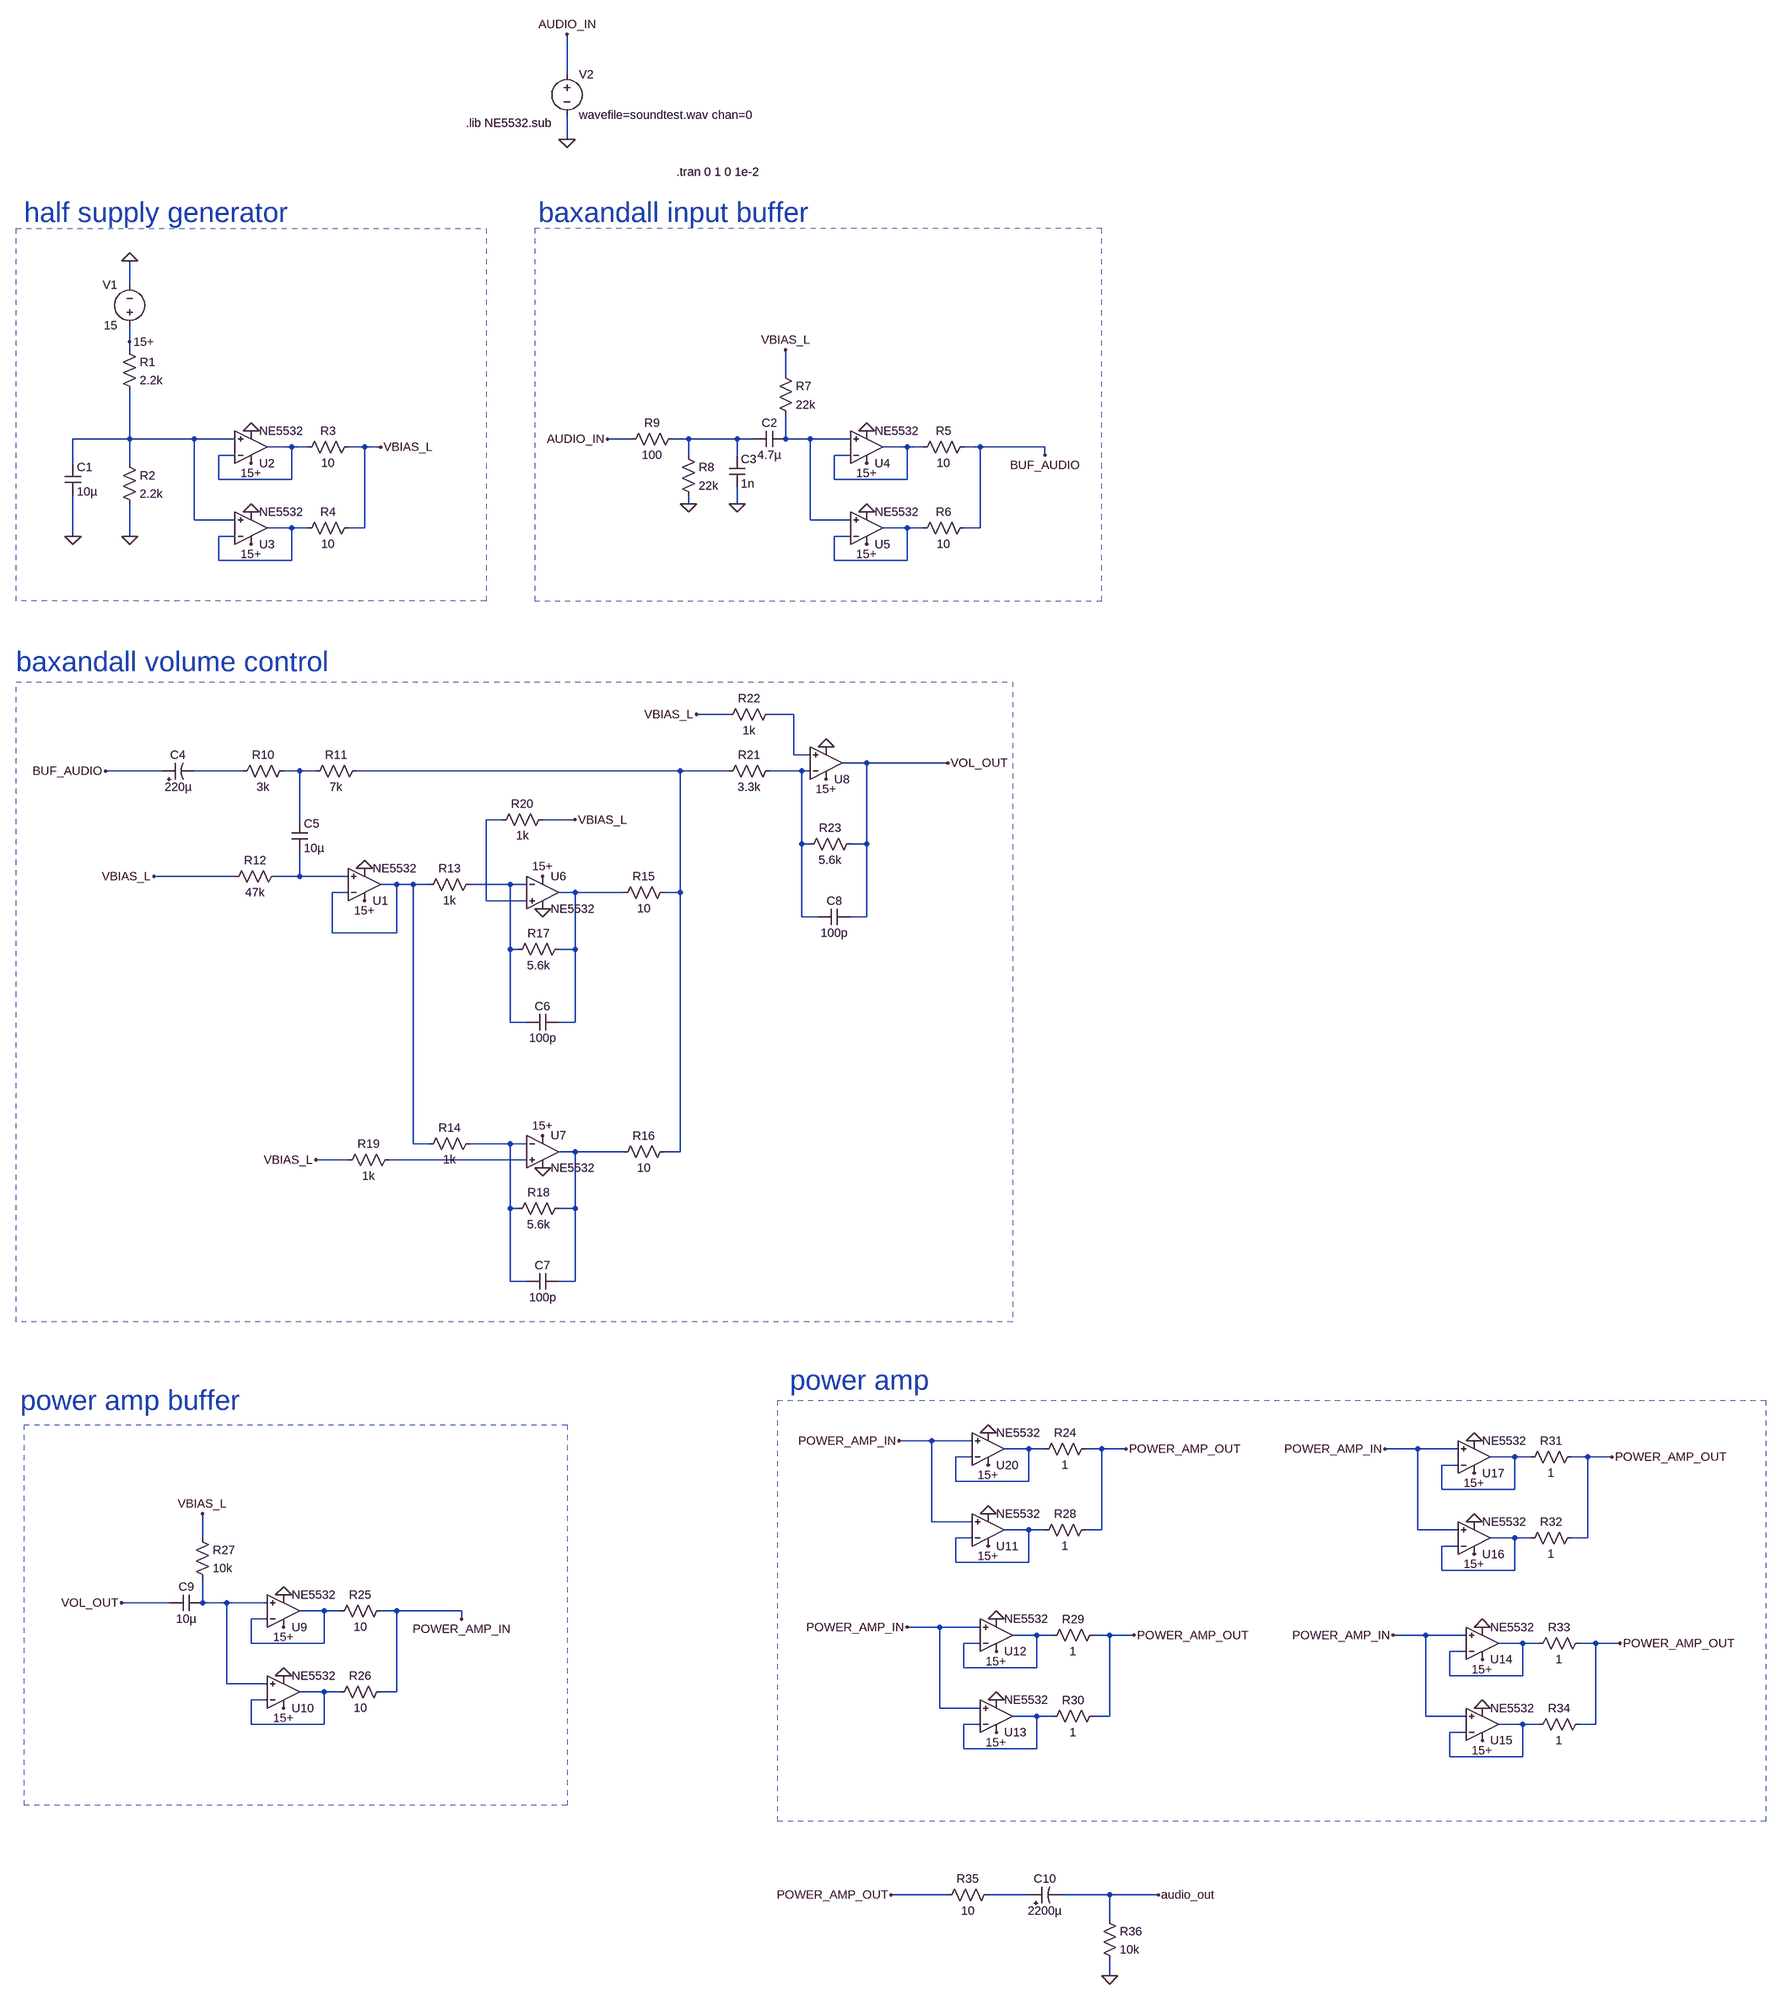
[diagram p0: schematic Amp sim.asc]
Amp sim.asc, the LTspice schematic file:
Version 4
SHEET 1 3236 3316
WIRE 864 -480 864 -560
WIRE 864 -352 864 -400
WIRE 0 -64 0 -112
WIRE 0 48 0 16
WIRE 0 64 0 48
WIRE 1296 112 1296 64
WIRE 0 240 0 144
WIRE 0 240 -112 240
WIRE 128 240 0 240
WIRE 208 240 128 240
WIRE 992 240 944 240
WIRE 1104 240 1072 240
WIRE 1200 240 1104 240
WIRE 1232 240 1200 240
WIRE 1296 240 1296 192
WIRE 1344 240 1296 240
WIRE 1424 240 1344 240
WIRE 320 256 272 256
WIRE 352 256 320 256
WIRE 464 256 432 256
WIRE 496 256 464 256
WIRE 1536 256 1488 256
WIRE 1568 256 1536 256
WIRE 1680 256 1648 256
WIRE 1808 256 1680 256
WIRE 208 272 176 272
WIRE 1104 272 1104 240
WIRE 1200 272 1200 240
WIRE 1424 272 1392 272
WIRE 1808 272 1808 256
WIRE -112 288 -112 240
WIRE 0 288 0 240
WIRE 176 320 176 272
WIRE 320 320 320 256
WIRE 320 320 176 320
WIRE 1392 320 1392 272
WIRE 1536 320 1536 256
WIRE 1536 320 1392 320
WIRE 1104 368 1104 352
WIRE 1200 368 1200 336
WIRE 128 400 128 240
WIRE 208 400 128 400
WIRE 1344 400 1344 240
WIRE 1424 400 1344 400
WIRE 320 416 272 416
WIRE 352 416 320 416
WIRE 464 416 464 256
WIRE 464 416 432 416
WIRE 1536 416 1488 416
WIRE 1568 416 1536 416
WIRE 1680 416 1680 256
WIRE 1680 416 1648 416
WIRE -112 432 -112 352
WIRE 0 432 0 368
WIRE 208 432 176 432
WIRE 1424 432 1392 432
WIRE 176 480 176 432
WIRE 320 480 320 416
WIRE 320 480 176 480
WIRE 1392 480 1392 432
WIRE 1536 480 1536 416
WIRE 1536 480 1392 480
WIRE 1184 784 1120 784
WIRE 1312 784 1264 784
WIRE 1312 864 1312 784
WIRE 1344 864 1312 864
WIRE 1456 880 1408 880
WIRE 1616 880 1456 880
WIRE 64 896 -48 896
WIRE 224 896 128 896
WIRE 336 896 304 896
WIRE 368 896 336 896
WIRE 1088 896 448 896
WIRE 1184 896 1088 896
WIRE 1328 896 1264 896
WIRE 1344 896 1328 896
WIRE 336 992 336 896
WIRE 736 992 704 992
WIRE 880 992 816 992
WIRE 1328 1040 1328 896
WIRE 1344 1040 1328 1040
WIRE 1456 1040 1456 880
WIRE 1456 1040 1424 1040
WIRE 208 1104 48 1104
WIRE 336 1104 336 1056
WIRE 336 1104 288 1104
WIRE 432 1104 336 1104
WIRE 528 1120 496 1120
WIRE 560 1120 528 1120
WIRE 592 1120 560 1120
WIRE 752 1120 672 1120
WIRE 784 1120 752 1120
WIRE 432 1136 400 1136
WIRE 880 1136 848 1136
WIRE 976 1136 880 1136
WIRE 1088 1136 1088 896
WIRE 1088 1136 1056 1136
WIRE 704 1152 704 992
WIRE 784 1152 704 1152
WIRE 1328 1184 1328 1040
WIRE 1360 1184 1328 1184
WIRE 1456 1184 1456 1040
WIRE 1456 1184 1424 1184
WIRE 400 1216 400 1136
WIRE 528 1216 528 1120
WIRE 528 1216 400 1216
WIRE 752 1248 752 1120
WIRE 768 1248 752 1248
WIRE 880 1248 880 1136
WIRE 880 1248 848 1248
WIRE 752 1392 752 1248
WIRE 784 1392 752 1392
WIRE 880 1392 880 1248
WIRE 880 1392 848 1392
WIRE 560 1632 560 1120
WIRE 592 1632 560 1632
WIRE 752 1632 672 1632
WIRE 784 1632 752 1632
WIRE 880 1648 848 1648
WIRE 976 1648 880 1648
WIRE 1088 1648 1088 1136
WIRE 1088 1648 1056 1648
WIRE 432 1664 368 1664
WIRE 784 1664 512 1664
WIRE 752 1760 752 1632
WIRE 768 1760 752 1760
WIRE 880 1760 880 1648
WIRE 880 1760 848 1760
WIRE 752 1904 752 1760
WIRE 784 1904 752 1904
WIRE 880 1904 880 1760
WIRE 880 1904 848 1904
WIRE 1584 2224 1520 2224
WIRE 1664 2224 1584 2224
WIRE 1776 2240 1728 2240
WIRE 1808 2240 1776 2240
WIRE 1920 2240 1888 2240
WIRE 1968 2240 1920 2240
WIRE 2544 2240 2480 2240
WIRE 2624 2240 2544 2240
WIRE 1664 2256 1632 2256
WIRE 2736 2256 2688 2256
WIRE 2768 2256 2736 2256
WIRE 2880 2256 2848 2256
WIRE 2928 2256 2880 2256
WIRE 2624 2272 2592 2272
WIRE 1632 2304 1632 2256
WIRE 1776 2304 1776 2240
WIRE 1776 2304 1632 2304
WIRE 2592 2320 2592 2272
WIRE 2736 2320 2736 2256
WIRE 2736 2320 2592 2320
WIRE 1584 2384 1584 2224
WIRE 1664 2384 1584 2384
WIRE 1776 2400 1728 2400
WIRE 1808 2400 1776 2400
WIRE 1920 2400 1920 2240
WIRE 1920 2400 1888 2400
WIRE 2544 2400 2544 2240
WIRE 2624 2400 2544 2400
WIRE 144 2416 144 2368
WIRE 1664 2416 1632 2416
WIRE 2736 2416 2688 2416
WIRE 2768 2416 2736 2416
WIRE 2880 2416 2880 2256
WIRE 2880 2416 2848 2416
WIRE 2624 2432 2592 2432
WIRE 1632 2464 1632 2416
WIRE 1776 2464 1776 2400
WIRE 1776 2464 1632 2464
WIRE 2592 2480 2592 2432
WIRE 2736 2480 2736 2416
WIRE 2736 2480 2592 2480
WIRE 80 2544 -16 2544
WIRE 144 2544 144 2496
WIRE 192 2544 144 2544
WIRE 272 2544 192 2544
WIRE 384 2560 336 2560
WIRE 416 2560 384 2560
WIRE 528 2560 496 2560
WIRE 656 2560 528 2560
WIRE 272 2576 240 2576
WIRE 656 2576 656 2560
WIRE 1600 2592 1536 2592
WIRE 1680 2592 1600 2592
WIRE 1792 2608 1744 2608
WIRE 1824 2608 1792 2608
WIRE 1936 2608 1904 2608
WIRE 1984 2608 1936 2608
WIRE 2560 2608 2496 2608
WIRE 2640 2608 2560 2608
WIRE 240 2624 240 2576
WIRE 384 2624 384 2560
WIRE 384 2624 240 2624
WIRE 1680 2624 1648 2624
WIRE 2752 2624 2704 2624
WIRE 2784 2624 2752 2624
WIRE 2896 2624 2864 2624
WIRE 2944 2624 2896 2624
WIRE 2640 2640 2608 2640
WIRE 1648 2672 1648 2624
WIRE 1792 2672 1792 2608
WIRE 1792 2672 1648 2672
WIRE 2608 2688 2608 2640
WIRE 2752 2688 2752 2624
WIRE 2752 2688 2608 2688
WIRE 192 2704 192 2544
WIRE 272 2704 192 2704
WIRE 384 2720 336 2720
WIRE 416 2720 384 2720
WIRE 528 2720 528 2560
WIRE 528 2720 496 2720
WIRE 272 2736 240 2736
WIRE 1600 2752 1600 2592
WIRE 1680 2752 1600 2752
WIRE 1792 2768 1744 2768
WIRE 1824 2768 1792 2768
WIRE 1936 2768 1936 2608
WIRE 1936 2768 1904 2768
WIRE 2560 2768 2560 2608
WIRE 2640 2768 2560 2768
WIRE 240 2784 240 2736
WIRE 384 2784 384 2720
WIRE 384 2784 240 2784
WIRE 1680 2784 1648 2784
WIRE 2752 2784 2704 2784
WIRE 2784 2784 2752 2784
WIRE 2896 2784 2896 2624
WIRE 2896 2784 2864 2784
WIRE 2640 2800 2608 2800
WIRE 1648 2832 1648 2784
WIRE 1792 2832 1792 2768
WIRE 1792 2832 1648 2832
WIRE 2608 2848 2608 2800
WIRE 2752 2848 2752 2784
WIRE 2752 2848 2608 2848
WIRE 1616 3136 1504 3136
WIRE 1776 3136 1696 3136
WIRE 1936 3136 1840 3136
WIRE 2032 3136 1936 3136
WIRE 1936 3184 1936 3136
WIRE 1936 3296 1936 3264
FLAG 0 -112 0
FLAG 0 432 0
FLAG -112 432 0
FLAG 496 256 VBIAS_L
FLAG 0 48 15+
FLAG 240 288 15+
FLAG 240 224 0
FLAG 240 384 0
FLAG 240 448 15+
FLAG 1456 288 15+
FLAG 1456 224 0
FLAG 1456 384 0
FLAG 1456 448 15+
FLAG 1808 272 BUF_AUDIO
FLAG 1200 368 0
FLAG 1296 64 VBIAS_L
FLAG 1104 368 0
FLAG 864 -352 0
FLAG 864 -560 AUDIO_IN
FLAG 944 240 AUDIO_IN
FLAG -48 896 BUF_AUDIO
FLAG 48 1104 VBIAS_L
FLAG 464 1152 15+
FLAG 464 1088 0
FLAG 816 1104 15+
FLAG 816 1168 0
FLAG 816 1616 15+
FLAG 816 1680 0
FLAG 368 1664 VBIAS_L
FLAG 880 992 VBIAS_L
FLAG 1376 912 15+
FLAG 1376 848 0
FLAG 1120 784 VBIAS_L
FLAG 1616 880 VOL_OUT
FLAG 304 2592 15+
FLAG 304 2528 0
FLAG 304 2688 0
FLAG 304 2752 15+
FLAG 656 2576 POWER_AMP_IN
FLAG 144 2368 VBIAS_L
FLAG -16 2544 VOL_OUT
FLAG 1696 2272 15+
FLAG 1696 2208 0
FLAG 1696 2368 0
FLAG 1696 2432 15+
FLAG 1520 2224 POWER_AMP_IN
FLAG 1968 2240 POWER_AMP_OUT
FLAG 1712 2640 15+
FLAG 1712 2576 0
FLAG 1712 2736 0
FLAG 1712 2800 15+
FLAG 1536 2592 POWER_AMP_IN
FLAG 1984 2608 POWER_AMP_OUT
FLAG 2656 2288 15+
FLAG 2656 2224 0
FLAG 2656 2384 0
FLAG 2656 2448 15+
FLAG 2480 2240 POWER_AMP_IN
FLAG 2928 2256 POWER_AMP_OUT
FLAG 2672 2656 15+
FLAG 2672 2592 0
FLAG 2672 2752 0
FLAG 2672 2816 15+
FLAG 2496 2608 POWER_AMP_IN
FLAG 2944 2624 POWER_AMP_OUT
FLAG 1504 3136 POWER_AMP_OUT
FLAG 1936 3296 0
FLAG 2032 3136 audio_out
SYMBOL res -16 48 R0
SYMATTR InstName R1
SYMATTR Value 2.2k
SYMBOL res -16 272 R0
SYMATTR InstName R2
SYMATTR Value 2.2k
SYMBOL cap -128 288 R0
SYMATTR InstName C1
SYMATTR Value 10µ
SYMBOL voltage 0 32 R180
WINDOW 0 24 96 Left 2
WINDOW 3 24 16 Left 2
WINDOW 123 0 0 Left 0
WINDOW 39 0 0 Left 0
SYMATTR InstName V1
SYMATTR Value 15
SYMBOL res 448 240 R90
WINDOW 0 0 56 VBottom 2
WINDOW 3 32 56 VTop 2
SYMATTR InstName R3
SYMATTR Value 10
SYMBOL res 448 400 R90
WINDOW 0 0 56 VBottom 2
WINDOW 3 32 56 VTop 2
SYMATTR InstName R4
SYMATTR Value 10
SYMBOL res 1664 240 R90
WINDOW 0 0 56 VBottom 2
WINDOW 3 32 56 VTop 2
SYMATTR InstName R5
SYMATTR Value 10
SYMBOL res 1664 400 R90
WINDOW 0 0 56 VBottom 2
WINDOW 3 32 56 VTop 2
SYMATTR InstName R6
SYMATTR Value 10
SYMBOL res 1280 96 R0
SYMATTR InstName R7
SYMATTR Value 22k
SYMBOL cap 1296 224 R90
WINDOW 0 0 32 VBottom 2
WINDOW 3 32 32 VTop 2
SYMATTR InstName C2
SYMATTR Value 4.7µ
SYMBOL cap 1184 272 R0
SYMATTR InstName C3
SYMATTR Value 1n
SYMBOL res 1088 256 R0
SYMATTR InstName R8
SYMATTR Value 22k
SYMBOL res 1088 224 R90
WINDOW 0 0 56 VBottom 2
WINDOW 3 32 56 VTop 2
SYMATTR InstName R9
SYMATTR Value 100
SYMBOL voltage 864 -496 R0
WINDOW 123 0 0 Left 0
WINDOW 39 0 0 Left 0
SYMATTR InstName V2
SYMATTR Value wavefile=soundtest.wav chan=0
SYMBOL polcap 64 912 R270
WINDOW 0 32 32 VTop 2
WINDOW 3 0 32 VBottom 2
SYMATTR InstName C4
SYMATTR Value 220µ
SYMBOL res 320 880 R90
WINDOW 0 0 56 VBottom 2
WINDOW 3 32 56 VTop 2
SYMATTR InstName R10
SYMATTR Value 3k
SYMBOL res 464 880 R90
WINDOW 0 0 56 VBottom 2
WINDOW 3 32 56 VTop 2
SYMATTR InstName R11
SYMATTR Value 7k
SYMBOL cap 320 992 R0
SYMATTR InstName C5
SYMATTR Value 10µ
SYMBOL res 304 1088 R90
WINDOW 0 0 56 VBottom 2
WINDOW 3 32 56 VTop 2
SYMATTR InstName R12
SYMATTR Value 47k
SYMBOL res 688 1104 R90
WINDOW 0 0 56 VBottom 2
WINDOW 3 32 56 VTop 2
SYMATTR InstName R13
SYMATTR Value 1k
SYMBOL res 688 1616 R90
WINDOW 0 0 56 VBottom 2
WINDOW 3 32 56 VTop 2
SYMATTR InstName R14
SYMATTR Value 1k
SYMBOL res 1072 1120 R90
WINDOW 0 0 56 VBottom 2
WINDOW 3 32 56 VTop 2
SYMATTR InstName R15
SYMATTR Value 10
SYMBOL res 1072 1632 R90
WINDOW 0 0 56 VBottom 2
WINDOW 3 32 56 VTop 2
SYMATTR InstName R16
SYMATTR Value 10
SYMBOL cap 848 1376 R90
WINDOW 0 0 32 VBottom 2
WINDOW 3 32 32 VTop 2
SYMATTR InstName C6
SYMATTR Value 100p
SYMBOL res 864 1232 R90
WINDOW 0 0 56 VBottom 2
WINDOW 3 32 56 VTop 2
SYMATTR InstName R17
SYMATTR Value 5.6k
SYMBOL cap 848 1888 R90
WINDOW 0 0 32 VBottom 2
WINDOW 3 32 32 VTop 2
SYMATTR InstName C7
SYMATTR Value 100p
SYMBOL res 864 1744 R90
WINDOW 0 0 56 VBottom 2
WINDOW 3 32 56 VTop 2
SYMATTR InstName R18
SYMATTR Value 5.6k
SYMBOL res 528 1648 R90
WINDOW 0 0 56 VBottom 2
WINDOW 3 32 56 VTop 2
SYMATTR InstName R19
SYMATTR Value 1k
SYMBOL res 720 1008 R270
WINDOW 0 32 56 VTop 2
WINDOW 3 0 56 VBottom 2
SYMATTR InstName R20
SYMATTR Value 1k
SYMBOL res 1280 880 R90
WINDOW 0 0 56 VBottom 2
WINDOW 3 32 56 VTop 2
SYMATTR InstName R21
SYMATTR Value 3.3k
SYMBOL OpAmps\\UniversalOpAmp 1376 880 M180
SYMATTR InstName U8
SYMBOL res 1280 768 R90
WINDOW 0 0 56 VBottom 2
WINDOW 3 32 56 VTop 2
SYMATTR InstName R22
SYMATTR Value 1k
SYMBOL cap 1424 1168 R90
WINDOW 0 0 32 VBottom 2
WINDOW 3 32 32 VTop 2
SYMATTR InstName C8
SYMATTR Value 100p
SYMBOL res 1440 1024 R90
WINDOW 0 0 56 VBottom 2
WINDOW 3 32 56 VTop 2
SYMATTR InstName R23
SYMATTR Value 5.6k
SYMBOL res 512 2544 R90
WINDOW 0 0 56 VBottom 2
WINDOW 3 32 56 VTop 2
SYMATTR InstName R25
SYMATTR Value 10
SYMBOL res 512 2704 R90
WINDOW 0 0 56 VBottom 2
WINDOW 3 32 56 VTop 2
SYMATTR InstName R26
SYMATTR Value 10
SYMBOL res 128 2400 R0
SYMATTR InstName R27
SYMATTR Value 10k
SYMBOL cap 144 2528 R90
WINDOW 0 0 32 VBottom 2
WINDOW 3 32 32 VTop 2
SYMATTR InstName C9
SYMATTR Value 10µ
SYMBOL res 1904 2224 R90
WINDOW 0 0 56 VBottom 2
WINDOW 3 32 56 VTop 2
SYMATTR InstName R24
SYMATTR Value 1
SYMBOL res 1904 2384 R90
WINDOW 0 0 56 VBottom 2
WINDOW 3 32 56 VTop 2
SYMATTR InstName R28
SYMATTR Value 1
SYMBOL res 1920 2592 R90
WINDOW 0 0 56 VBottom 2
WINDOW 3 32 56 VTop 2
SYMATTR InstName R29
SYMATTR Value 1
SYMBOL res 1920 2752 R90
WINDOW 0 0 56 VBottom 2
WINDOW 3 32 56 VTop 2
SYMATTR InstName R30
SYMATTR Value 1
SYMBOL res 2864 2240 R90
WINDOW 0 0 56 VBottom 2
WINDOW 3 32 56 VTop 2
SYMATTR InstName R31
SYMATTR Value 1
SYMBOL res 2864 2400 R90
WINDOW 0 0 56 VBottom 2
WINDOW 3 32 56 VTop 2
SYMATTR InstName R32
SYMATTR Value 1
SYMBOL res 2880 2608 R90
WINDOW 0 0 56 VBottom 2
WINDOW 3 32 56 VTop 2
SYMATTR InstName R33
SYMATTR Value 1
SYMBOL res 2880 2768 R90
WINDOW 0 0 56 VBottom 2
WINDOW 3 32 56 VTop 2
SYMATTR InstName R34
SYMATTR Value 1
SYMBOL res 1712 3120 R90
WINDOW 0 0 56 VBottom 2
WINDOW 3 32 56 VTop 2
SYMATTR InstName R35
SYMATTR Value 10
SYMBOL polcap 1776 3152 R270
WINDOW 0 32 32 VTop 2
WINDOW 3 0 32 VBottom 2
SYMATTR InstName C10
SYMATTR Value 2200µ
SYMBOL res 1920 3168 R0
SYMATTR InstName R36
SYMATTR Value 10k
SYMBOL OpAmps\\opamp2 1696 2304 M180
SYMATTR InstName U20
SYMATTR Value NE5532
SYMBOL OpAmps\\opamp2 240 320 M180
SYMATTR InstName U2
SYMATTR Value NE5532
SYMBOL OpAmps\\opamp2 240 480 M180
SYMATTR InstName U3
SYMATTR Value NE5532
SYMBOL OpAmps\\opamp2 1456 320 M180
SYMATTR InstName U4
SYMATTR Value NE5532
SYMBOL OpAmps\\opamp2 1456 480 M180
SYMATTR InstName U5
SYMATTR Value NE5532
SYMBOL OpAmps\\opamp2 464 1184 M180
SYMATTR InstName U1
SYMATTR Value NE5532
SYMBOL OpAmps\\opamp2 816 1072 R0
SYMATTR InstName U6
SYMATTR Value NE5532
SYMBOL OpAmps\\opamp2 816 1584 R0
SYMATTR InstName U7
SYMATTR Value NE5532
SYMBOL OpAmps\\opamp2 304 2624 M180
SYMATTR InstName U9
SYMATTR Value NE5532
SYMBOL OpAmps\\opamp2 304 2784 M180
SYMATTR InstName U10
SYMATTR Value NE5532
SYMBOL OpAmps\\opamp2 1696 2464 M180
SYMATTR InstName U11
SYMATTR Value NE5532
SYMBOL OpAmps\\opamp2 1712 2672 M180
SYMATTR InstName U12
SYMATTR Value NE5532
SYMBOL OpAmps\\opamp2 1712 2832 M180
SYMATTR InstName U13
SYMATTR Value NE5532
SYMBOL OpAmps\\opamp2 2672 2688 M180
SYMATTR InstName U14
SYMATTR Value NE5532
SYMBOL OpAmps\\opamp2 2672 2848 M180
SYMATTR InstName U15
SYMATTR Value NE5532
SYMBOL OpAmps\\opamp2 2656 2480 M180
SYMATTR InstName U16
SYMATTR Value NE5532
SYMBOL OpAmps\\opamp2 2656 2320 M180
SYMATTR InstName U17
SYMATTR Value NE5532
TEXT 1080 -288 Left 2 !.tran 0 1 0 1e-2
TEXT -208 -208 Left 5 ;half supply generator
TEXT 808 -208 Left 5 ;baxandall input buffer
TEXT -224 680 Left 5 ;baxandall volume control
TEXT -216 2144 Left 5 ;power amp buffer
TEXT 1304 2104 Left 5 ;power amp
TEXT 664 -384 Left 2 !.lib NE5532.sub
RECTANGLE Normal 704 560 -224 -176 2
RECTANGLE Normal 1920 -176 800 560 2
RECTANGLE Normal 1744 1984 -224 720 2
RECTANGLE Normal 864 2944 -208 2192 2
RECTANGLE Normal 3232 2976 1280 2144 2

The netlist it stands for:
* Amp sim.asc
R1 15+ N001 2.2k
R2 N001 0 2.2k
C1 N001 0 10µ
V1 15+ 0 15
R3 VBIAS_L N004 10
R4 VBIAS_L N006 10
R5 BUF_AUDIO N005 10
R6 BUF_AUDIO N007 10
R7 VBIAS_L N003 22k
C2 N003 N002 4.7µ
C3 N002 0 1n
R8 N002 0 22k
R9 N002 AUDIO_IN 100
V2 AUDIO_IN 0 wavefile=soundtest.wav chan=0
C4 BUF_AUDIO N009 220µ
R10 N010 N009 3k
R11 N011 N010 7k
C5 N010 N014 10µ
R12 N014 VBIAS_L 47k
R13 N016 N015 1k
R14 N018 N015 1k
R15 N011 N017 10
R16 N011 N019 10
C6 N017 N016 100p
R17 N017 N016 5.6k
C7 N019 N018 100p
R18 N019 N018 5.6k
R19 N020 VBIAS_L 1k
R20 N013 VBIAS_L 1k
R21 N012 N011 3.3k
XU8 N008 N012 15+ 0 VOL_OUT level1 Avol=1Meg GBW=10Meg Vos=0 En=0 Enk=0 In=0 Ink=0 Rin=500Meg  ; pins In+ In- V+ V- OUT
R22 N008 VBIAS_L 1k
C8 VOL_OUT N012 100p
R23 VOL_OUT N012 5.6k
R25 POWER_AMP_IN N026 10
R26 POWER_AMP_IN N029 10
R27 VBIAS_L N025 10k
C9 N025 VOL_OUT 10µ
R24 POWER_AMP_OUT N021 1
R28 POWER_AMP_OUT N023 1
R29 POWER_AMP_OUT N027 1
R30 POWER_AMP_OUT N030 1
R31 POWER_AMP_OUT N022 1
R32 POWER_AMP_OUT N024 1
R33 POWER_AMP_OUT N028 1
R34 POWER_AMP_OUT N031 1
R35 N032 POWER_AMP_OUT 10
C10 N032 audio_out 2200µ
R36 audio_out 0 10k
XU20 POWER_AMP_IN N021 15+ 0 N021 NE5532  ; pins In+ In- V+ V- OUT
XU2 N001 N004 15+ 0 N004 NE5532  ; pins In+ In- V+ V- OUT
XU3 N001 N006 15+ 0 N006 NE5532  ; pins In+ In- V+ V- OUT
XU4 N003 N005 15+ 0 N005 NE5532  ; pins In+ In- V+ V- OUT
XU5 N003 N007 15+ 0 N007 NE5532  ; pins In+ In- V+ V- OUT
XU1 N014 N015 15+ 0 N015 NE5532  ; pins In+ In- V+ V- OUT
XU6 N013 N016 15+ 0 N017 NE5532  ; pins In+ In- V+ V- OUT
XU7 N020 N018 15+ 0 N019 NE5532  ; pins In+ In- V+ V- OUT
XU9 N025 N026 15+ 0 N026 NE5532  ; pins In+ In- V+ V- OUT
XU10 N025 N029 15+ 0 N029 NE5532  ; pins In+ In- V+ V- OUT
XU11 POWER_AMP_IN N023 15+ 0 N023 NE5532  ; pins In+ In- V+ V- OUT
XU12 POWER_AMP_IN N027 15+ 0 N027 NE5532  ; pins In+ In- V+ V- OUT
XU13 POWER_AMP_IN N030 15+ 0 N030 NE5532  ; pins In+ In- V+ V- OUT
XU14 POWER_AMP_IN N028 15+ 0 N028 NE5532  ; pins In+ In- V+ V- OUT
XU15 POWER_AMP_IN N031 15+ 0 N031 NE5532  ; pins In+ In- V+ V- OUT
XU16 POWER_AMP_IN N024 15+ 0 N024 NE5532  ; pins In+ In- V+ V- OUT
XU17 POWER_AMP_IN N022 15+ 0 N022 NE5532  ; pins In+ In- V+ V- OUT
.tran 0 1 0 1e-2
* half supply generator
* baxandall input buffer
* baxandall volume control
* power amp buffer
* power amp
.lib NE5532.sub
.lib UniversalOpAmp1.lib
.backanno
.end